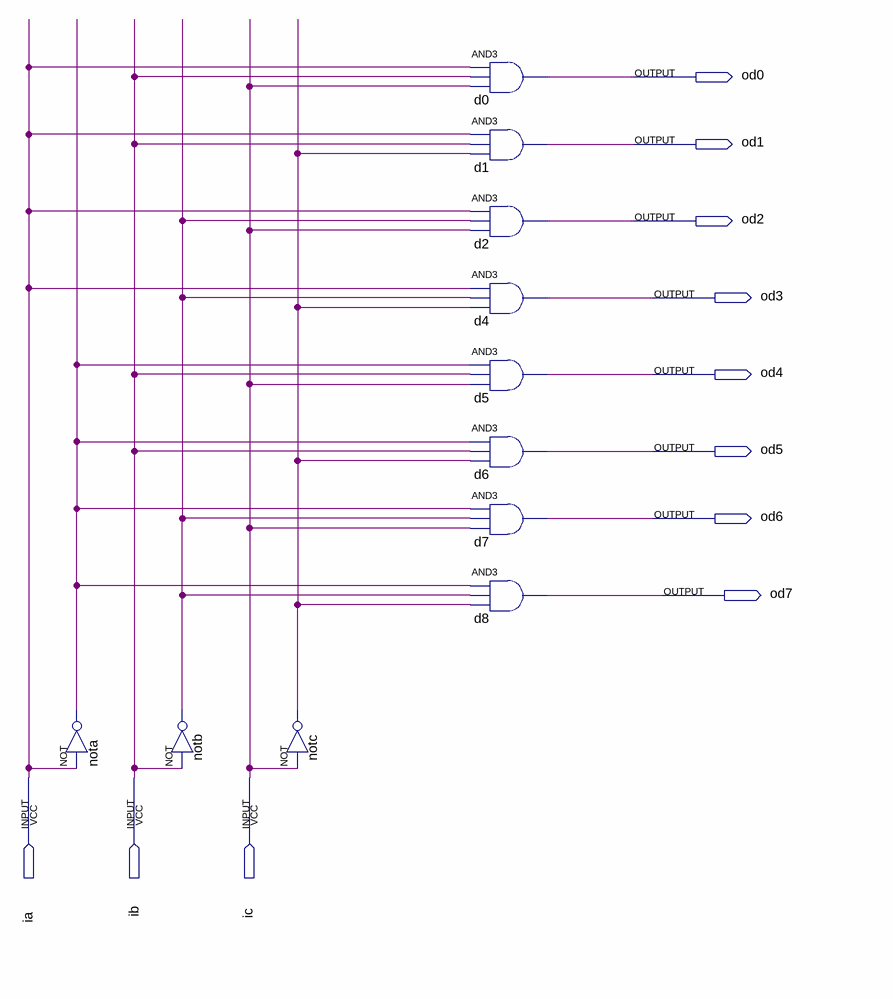
[diagram p0: schematic sheet]
// Quartus schematic Decoder3_8.bdf as structural Verilog: 11 symbols, 11 pins
module Decoder3_8 (
  input  ia,
  input  ib,
  input  ic,
  output od0,
  output od1,
  output od2,
  output od3,
  output od4,
  output od5,
  output od6,
  output od7
);

  wire nota_out, notb_out, notc_out;

  not nota (nota_out, ia);
  not notb (notb_out, ib);
  not notc (notc_out, ic);
  and d0 (od0, ia, ib, ic);
  and d1 (od1, ia, ib, notc_out);
  and d2 (od2, ia, notb_out, ic);
  and d4 (od3, ia, notb_out, notc_out);
  and d5 (od4, nota_out, ib, ic);
  and d6 (od5, nota_out, ib, notc_out);
  and d7 (od6, nota_out, notb_out, ic);
  and d8 (od7, nota_out, notb_out, notc_out);
endmodule
